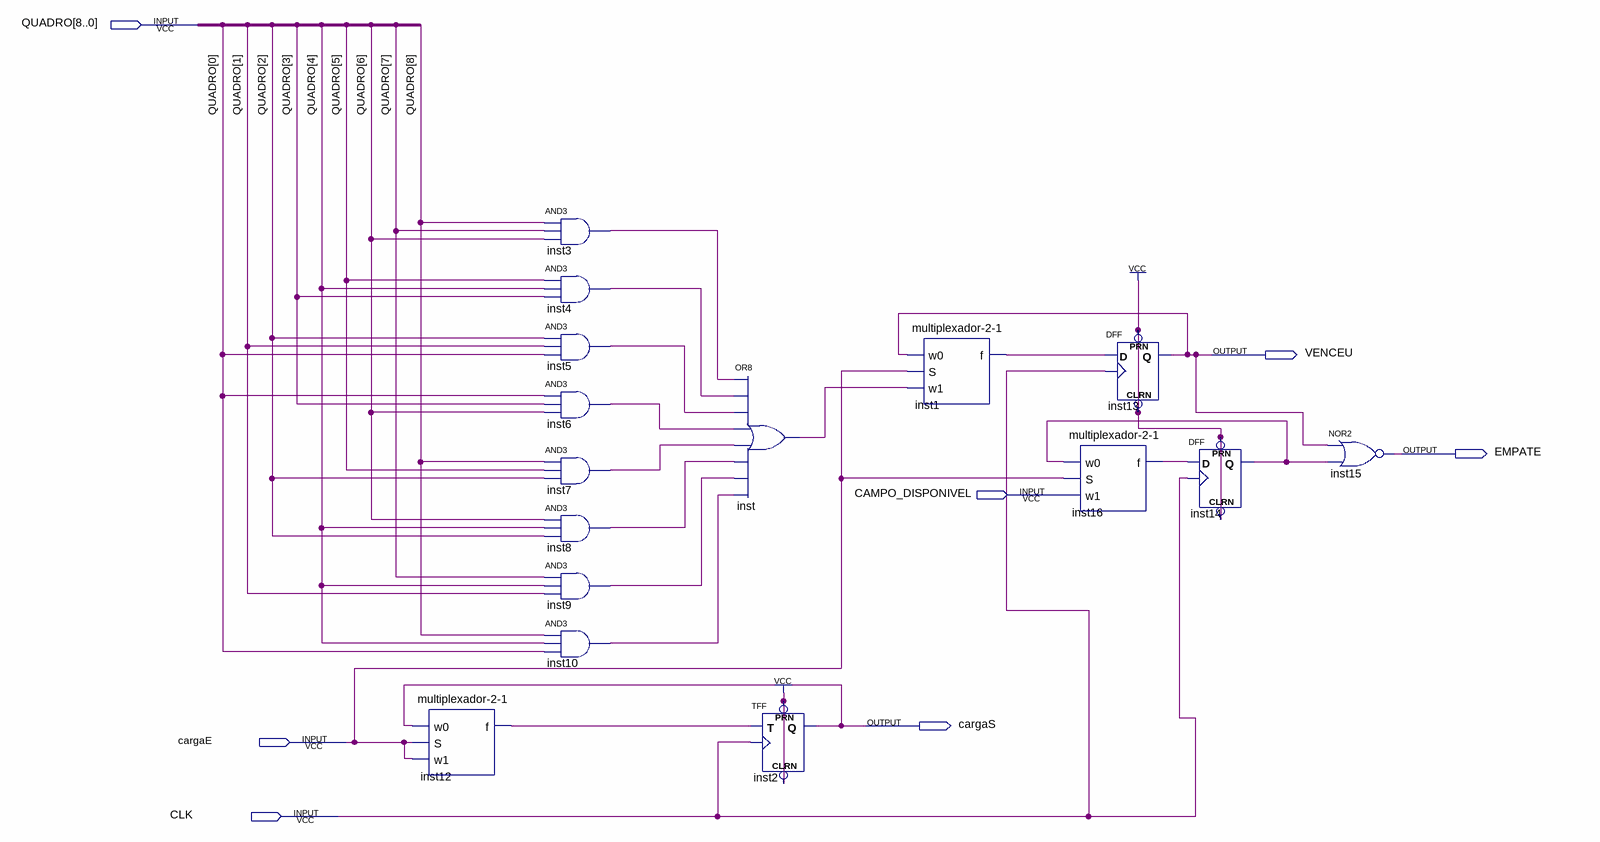
[diagram p0: schematic sheet]
// Quartus schematic verificar_se_venceu.bdf as structural Verilog: 16 symbols, 7 pins
module verificar_se_venceu (
  input  [8:0] QUADRO,
  input  CAMPO_DISPONIVEL,
  input  cargaE,
  input  CLK,
  output VENCEU,
  output EMPATE,
  output cargaS
);

  wire inst1_f, inst3_out, inst4_out, inst5_out, inst6_out, inst7_out, inst8_out, inst9_out, inst10_out,
       inst12_f, inst14_q, inst16_f, inst_out;

  \multiplexador-2-1  inst12 (.w0(cargaS), .S(cargaE), .w1(cargaE), .f(inst12_f));
  and inst3 (inst3_out, QUADRO[8], QUADRO[7], QUADRO[6]);
  and inst4 (inst4_out, QUADRO[5], QUADRO[4], QUADRO[3]);
  and inst5 (inst5_out, QUADRO[2], QUADRO[1], QUADRO[0]);
  and inst6 (inst6_out, QUADRO[0], QUADRO[3], QUADRO[6]);
  and inst7 (inst7_out, QUADRO[8], QUADRO[5], QUADRO[2]);
  and inst8 (inst8_out, QUADRO[6], QUADRO[4], QUADRO[2]);
  and inst9 (inst9_out, QUADRO[7], QUADRO[4], QUADRO[1]);
  and inst10 (inst10_out, QUADRO[8], QUADRO[4], QUADRO[0]);
  or inst (inst_out, inst3_out, inst4_out, inst5_out, inst6_out, inst7_out, inst8_out, inst9_out, inst10_out);
  TFF inst2 (.PRN(1'b1), .CLRN(1'b1), .T(inst12_f), .CLK(CLK), .Q(cargaS));
  \multiplexador-2-1  inst1 (.w0(VENCEU), .S(cargaE), .w1(inst_out), .f(inst1_f));
  DFF inst13 (.CLRN(1'b1), .CLK(CLK), .D(inst1_f), .PRN(1'b1), .Q(VENCEU));
  \multiplexador-2-1  inst16 (.w0(inst14_q), .S(cargaE), .w1(CAMPO_DISPONIVEL), .f(inst16_f));
  DFF inst14 (.CLRN(1'b1), .CLK(CLK), .D(inst16_f), .PRN(1'b1), .Q(inst14_q));
  nor inst15 (EMPATE, VENCEU, inst14_q);
endmodule
